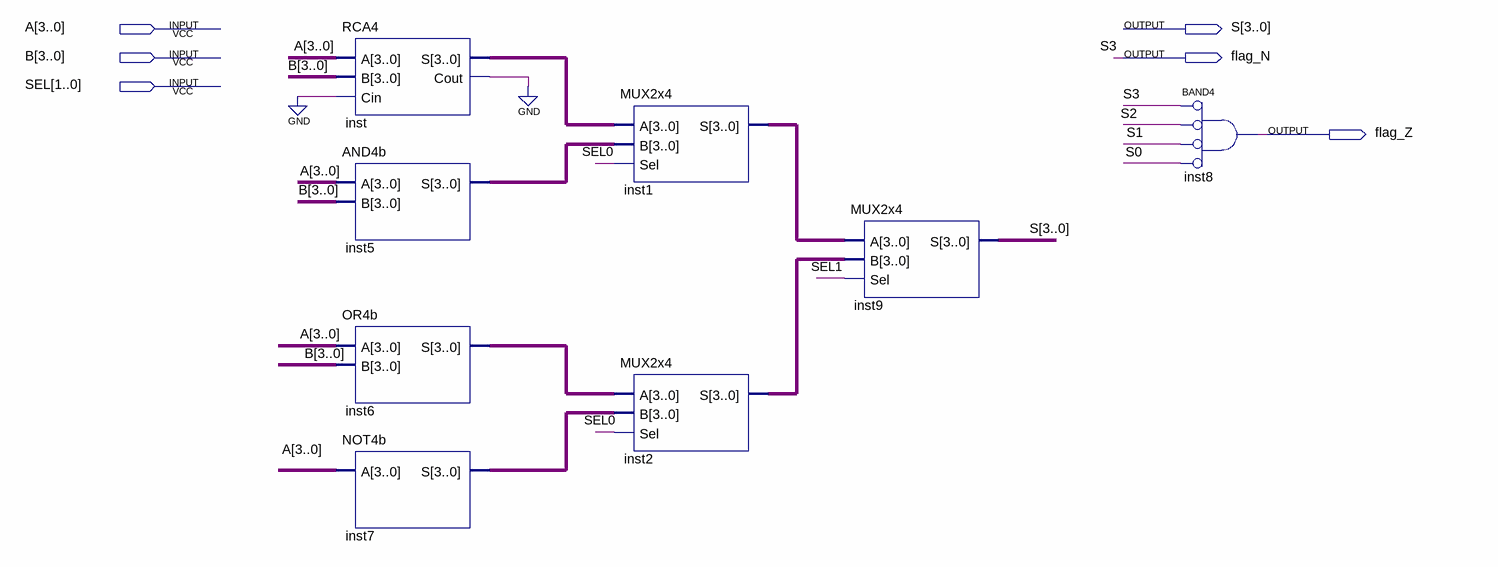
[diagram p0: schematic sheet]
// Quartus schematic ULA.bdf as structural Verilog: 8 symbols, 6 pins
module ULA (
  input  [3:0] A,
  input  [3:0] B,
  input  [1:0] SEL,
  output [3:0] S,
  output flag_N,
  output flag_Z
);

  wire inst_cout;
  wire [3:0] inst1_s, inst2_s, inst5_s, inst6_s, inst7_s, inst_s;

  RCA4 inst (.A(A), .B(B), .Cin(1'b0), .S(inst_s), .Cout(inst_cout));
  AND4b inst5 (.A(A), .B(B), .S(inst5_s));
  OR4b inst6 (.A(A), .B(B), .S(inst6_s));
  NOT4b inst7 (.A(A), .S(inst7_s));
  MUX2x4 inst1 (.A(inst_s), .B(inst5_s), .Sel(SEL[0]), .S(inst1_s));
  MUX2x4 inst2 (.A(inst6_s), .B(inst7_s), .Sel(SEL[0]), .S(inst2_s));
  MUX2x4 inst9 (.A(inst1_s), .B(inst2_s), .Sel(SEL[1]), .S({flag_N, S[2:0]}));
  and inst8 (flag_Z, ~flag_N, ~S[2], ~S[1], ~S[0]);  // BAND4

  assign S[3] = flag_N;
  // also tied to GND on the sheet: inst_cout

  // Other names for the same wires on the sheet: S3 = flag_N
endmodule
